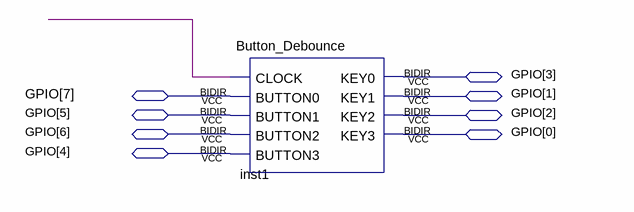
[diagram p0: schematic sheet]
// Quartus schematic TempButtonCodec.bdf as structural Verilog: 1 symbols, 8 pins
module TempButtonCodec (
  inout  [7:0] GPIO
);

  wire undriven;

  Button_Debounce inst1 (
    .CLOCK(undriven), .BUTTON0(GPIO[7]), .BUTTON1(GPIO[5]), .BUTTON2(GPIO[6]), .BUTTON3(GPIO[4]),
    .KEY0(GPIO[3]), .KEY1(GPIO[1]), .KEY2(GPIO[2]), .KEY3(GPIO[0]));
endmodule
